# Altium project RC-filters.PrjPcb
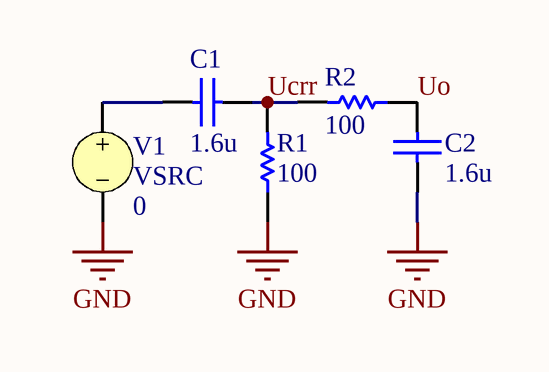
[diagram p0: Sheet2.SchDoc]
2 sheets, 9 parts. Net scope: global (net labels, ports and power ports of the same name join across sheets).
Sheets:
  Sheet2.SchDoc
  Sheet1.SchDoc

## Sheet Sheet2.SchDoc
size A4; DocumentNumber: 1; SheetNumber: 1; SheetTotal: 2

### Parts
C1  value 1.6u  (hidden comment: Capacitor)
C2  value 1.6u  (hidden comment: Capacitor)
R1  value 100  (hidden comment: Resistor)
R2  value 100  (hidden comment: Resistor)
V1  VSRC  DC Magnitude: 0

### Nets
GND: C2.1 R1.1 V1.2
Ucrr: C1.2 R1.2 R2.2
Uo: C2.2 R2.1
NetC1_1: C1.1 V1.1

### Library data of the parts
C1 C2 = Capacitor: SimulationGenericComponent: True
R1 R2 = Resistor: TC1: 0; SimulationGenericComponent: True; TC2: 0
V1 = VSRC: Voltage Source; Note: PCB Footprint - Not required; AC Magnitude: 1; Frequency: 1K; Published: 30-July-2020; LatestRevisionDate: 30-July-2020; LatestRevisionNote: Re-released for DXP Platform.; PackageReference: Not Applicable; Publisher: Altium Limited; AC Phase: 0; Offset: 0; Amplitude: 1; Delay: 0; Damping Factor: 0; Phase: 0

## Sheet Sheet1.SchDoc
size A4; SheetNumber: 2; SheetTotal: 2
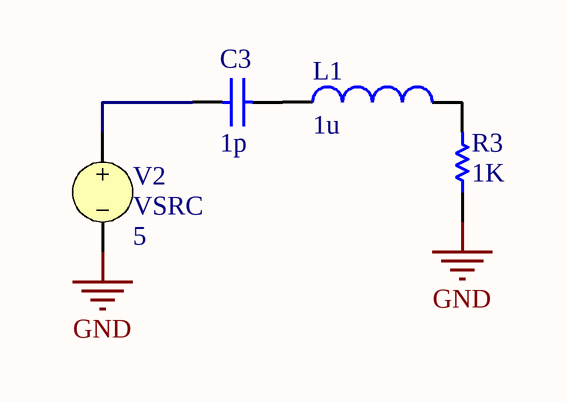
[diagram p1: Sheet1.SchDoc]

### Parts
C3  value 1p  (hidden comment: Capacitor)
L1  value 1u  (hidden comment: Inductor)
R3  value 1K  (hidden comment: Resistor)
V2  VSRC  value 5

### Nets
GND: R3.1 V2.2
NetC3_1: C3.1 V2.1
NetC3_2: C3.2 L1.1
NetL1_2: L1.2 R3.2

### Library data of the parts
C3 = Capacitor: SimulationGenericComponent: True
L1 = Inductor: SimulationGenericComponent: True
R3 = Resistor: TC1: 0; SimulationGenericComponent: True; TC2: 0
V2 = VSRC: Voltage Source; Note: PCB Footprint - Not required; AC Magnitude: 1; AC Phase: 0; Published: 30-July-2020; LatestRevisionDate: 30-July-2020; LatestRevisionNote: Re-released for DXP Platform.; PackageReference: Not Applicable; Publisher: Altium Limited

## Nets that join several sheets
GND: Sheet2 (C2.1 R1.1 V1.2), Sheet1 (R3.1 V2.2)